# EasyEDA Pro project car1.eprj, schematic Schematic2

## Sheets
1 control: Board Name: Board2; Create Date: 2024-12-06; Page Name: control; Project Name: car1; Schematic Name: Schematic2; Update Date: 2025-03-01; Company: 嘉立创EDA; Page Size: A4; Version: V1.0
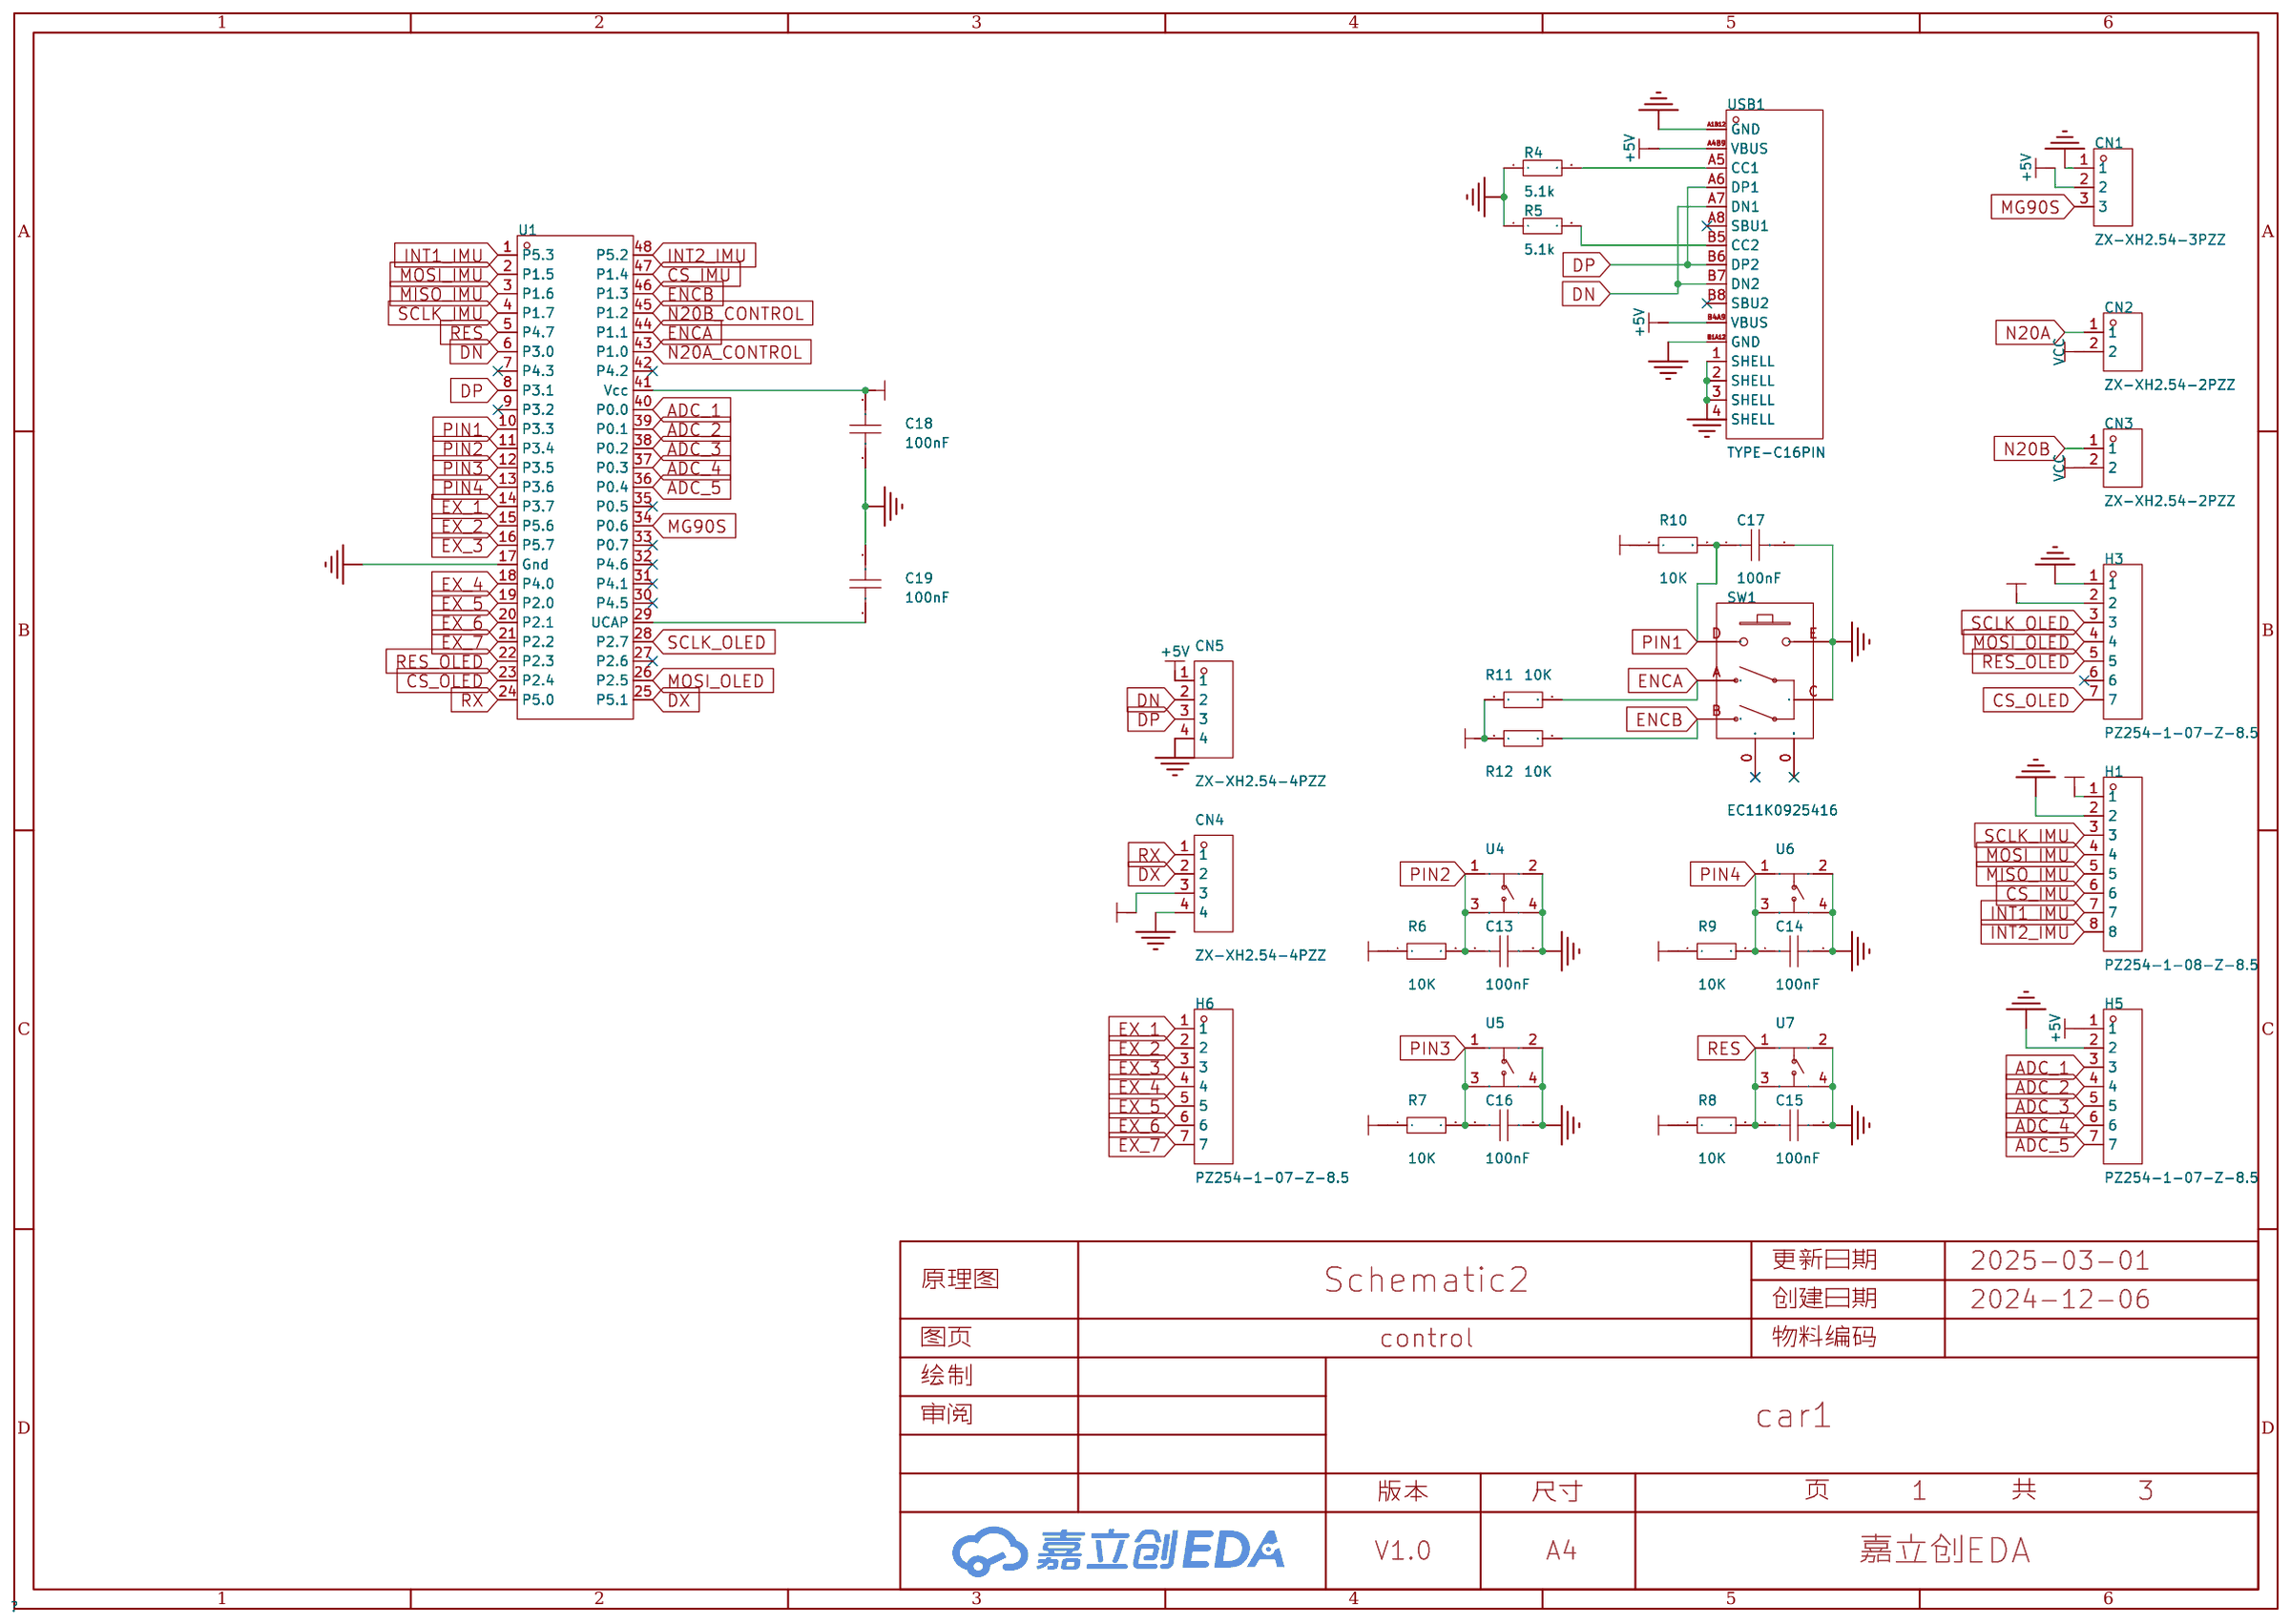
[diagram p1: control]
2 Power: Page Name: Power; Update Date: 2025-03-04
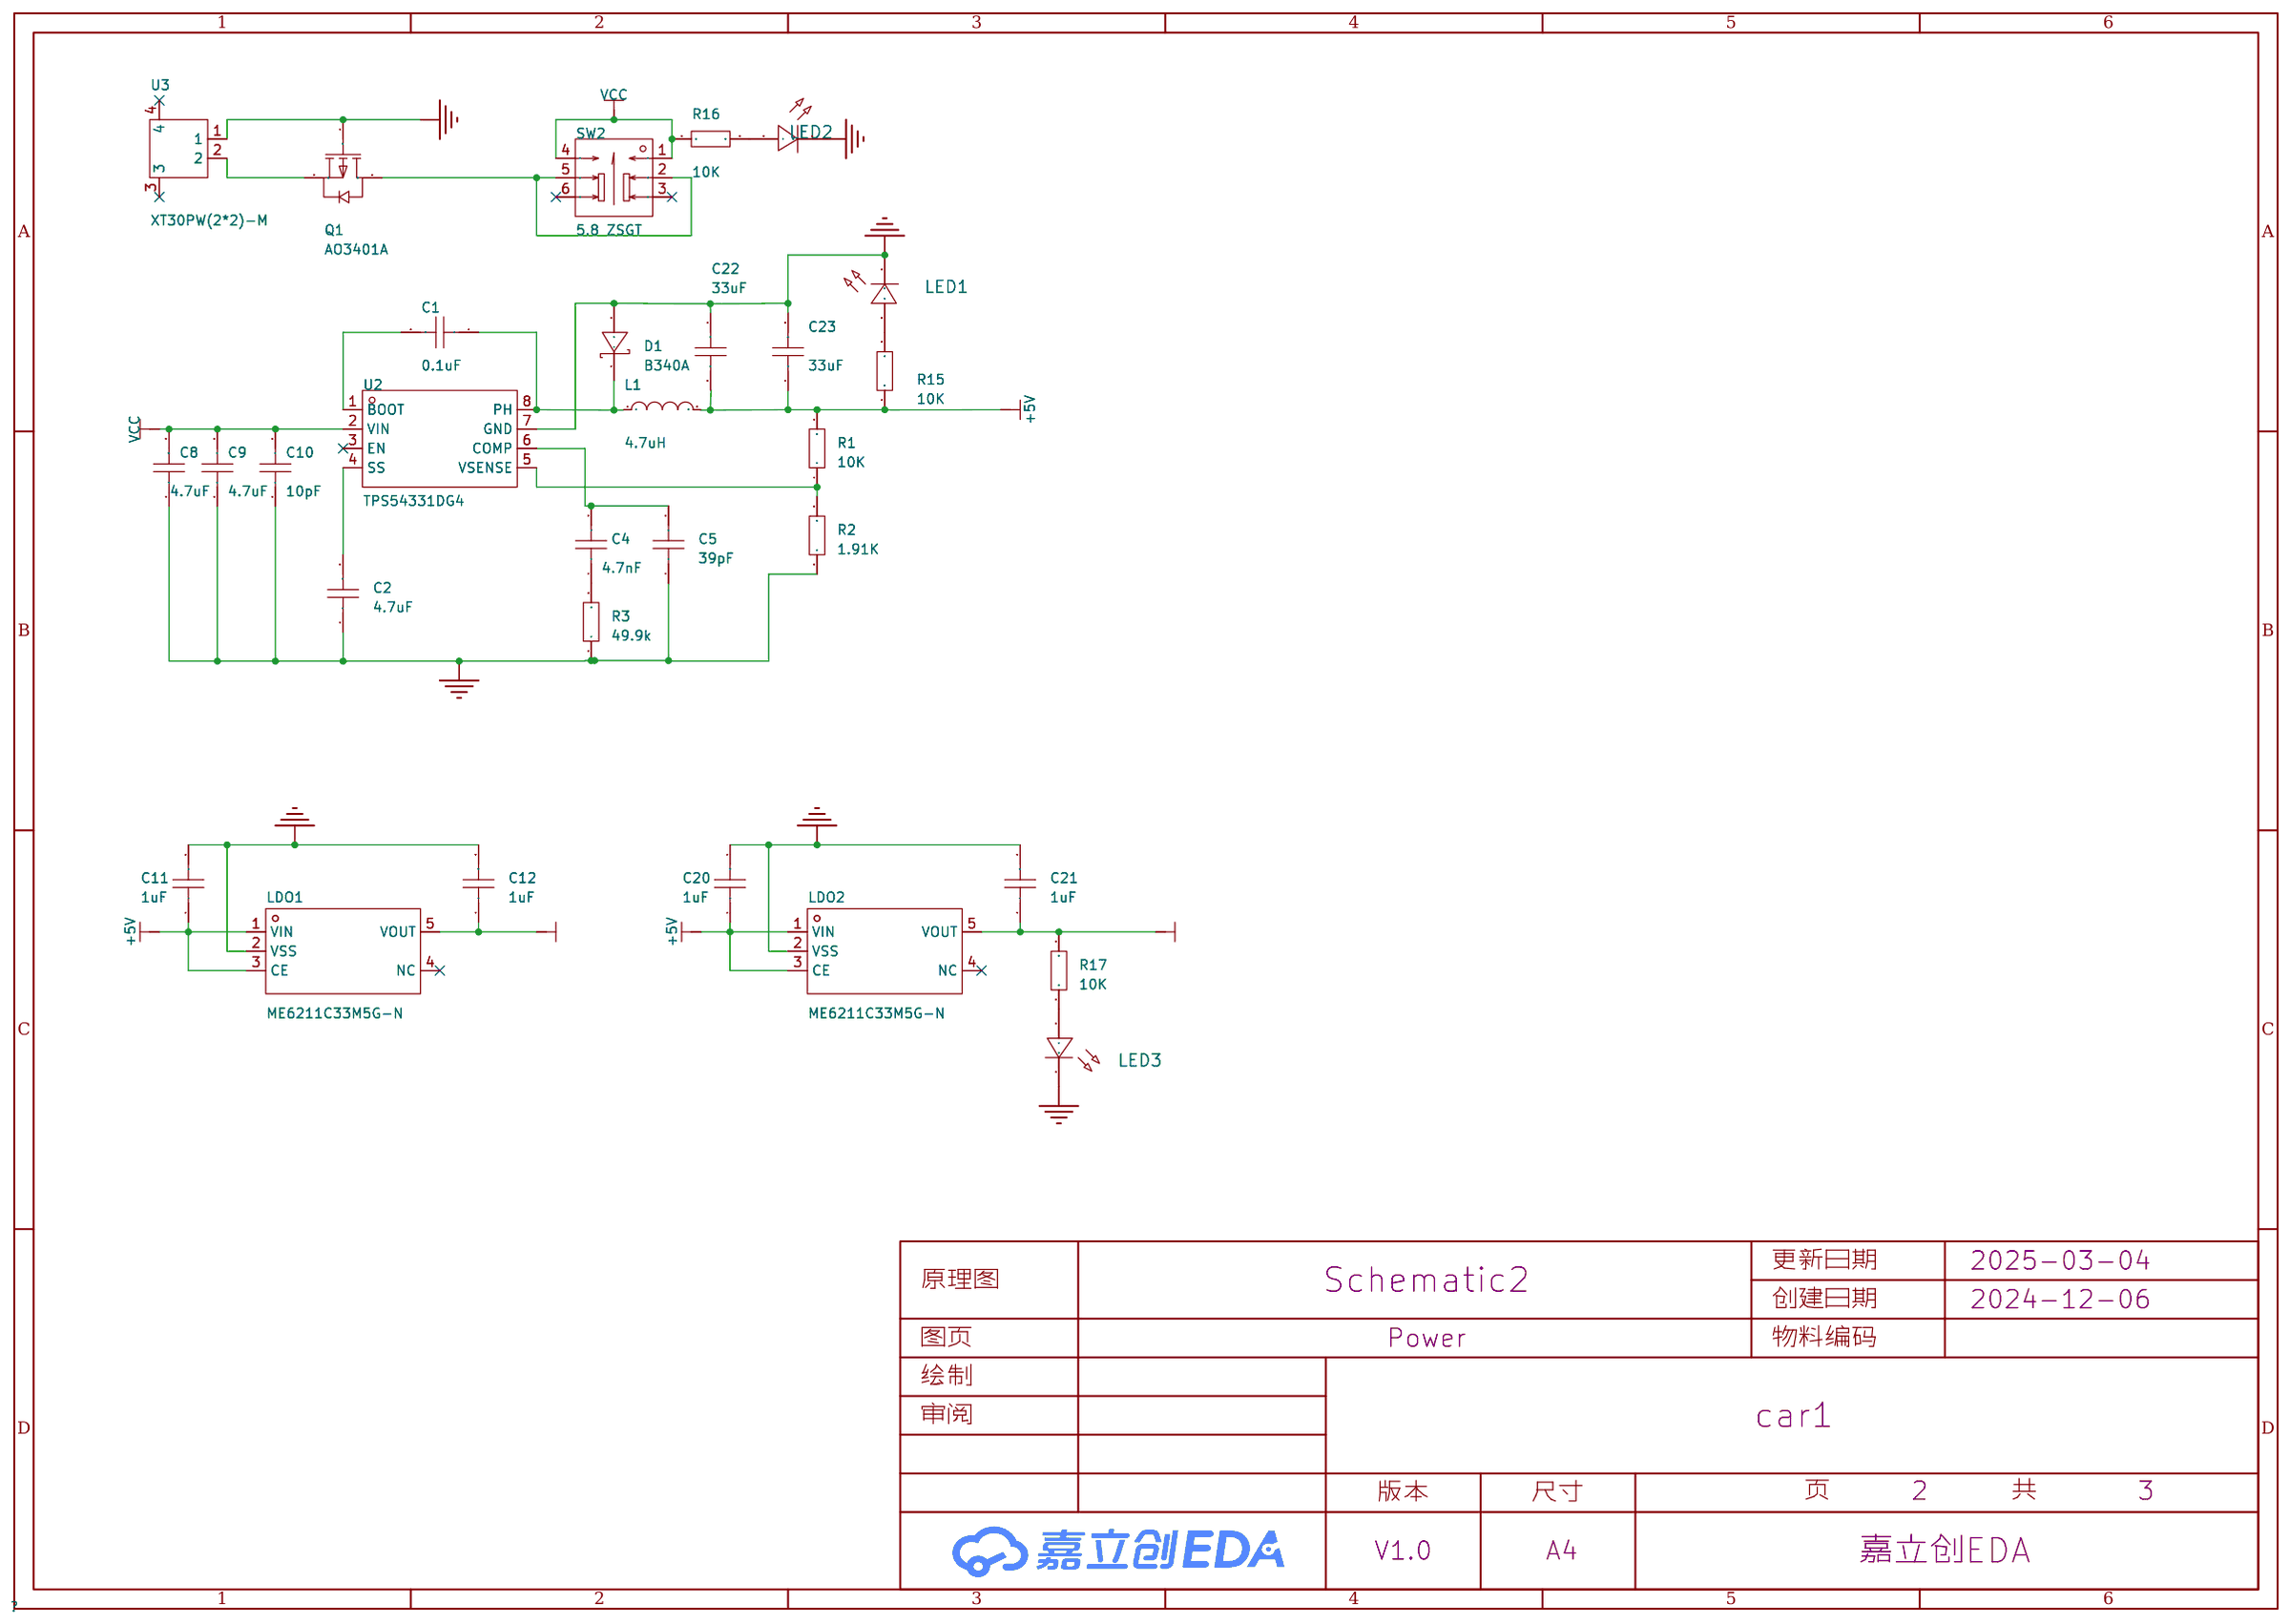
[diagram p2: Power]
3 3.Motor_Drive: Create Date: 2025-01-20; Page Name: 3.Motor_Drive; Update Date: 2025-02-26
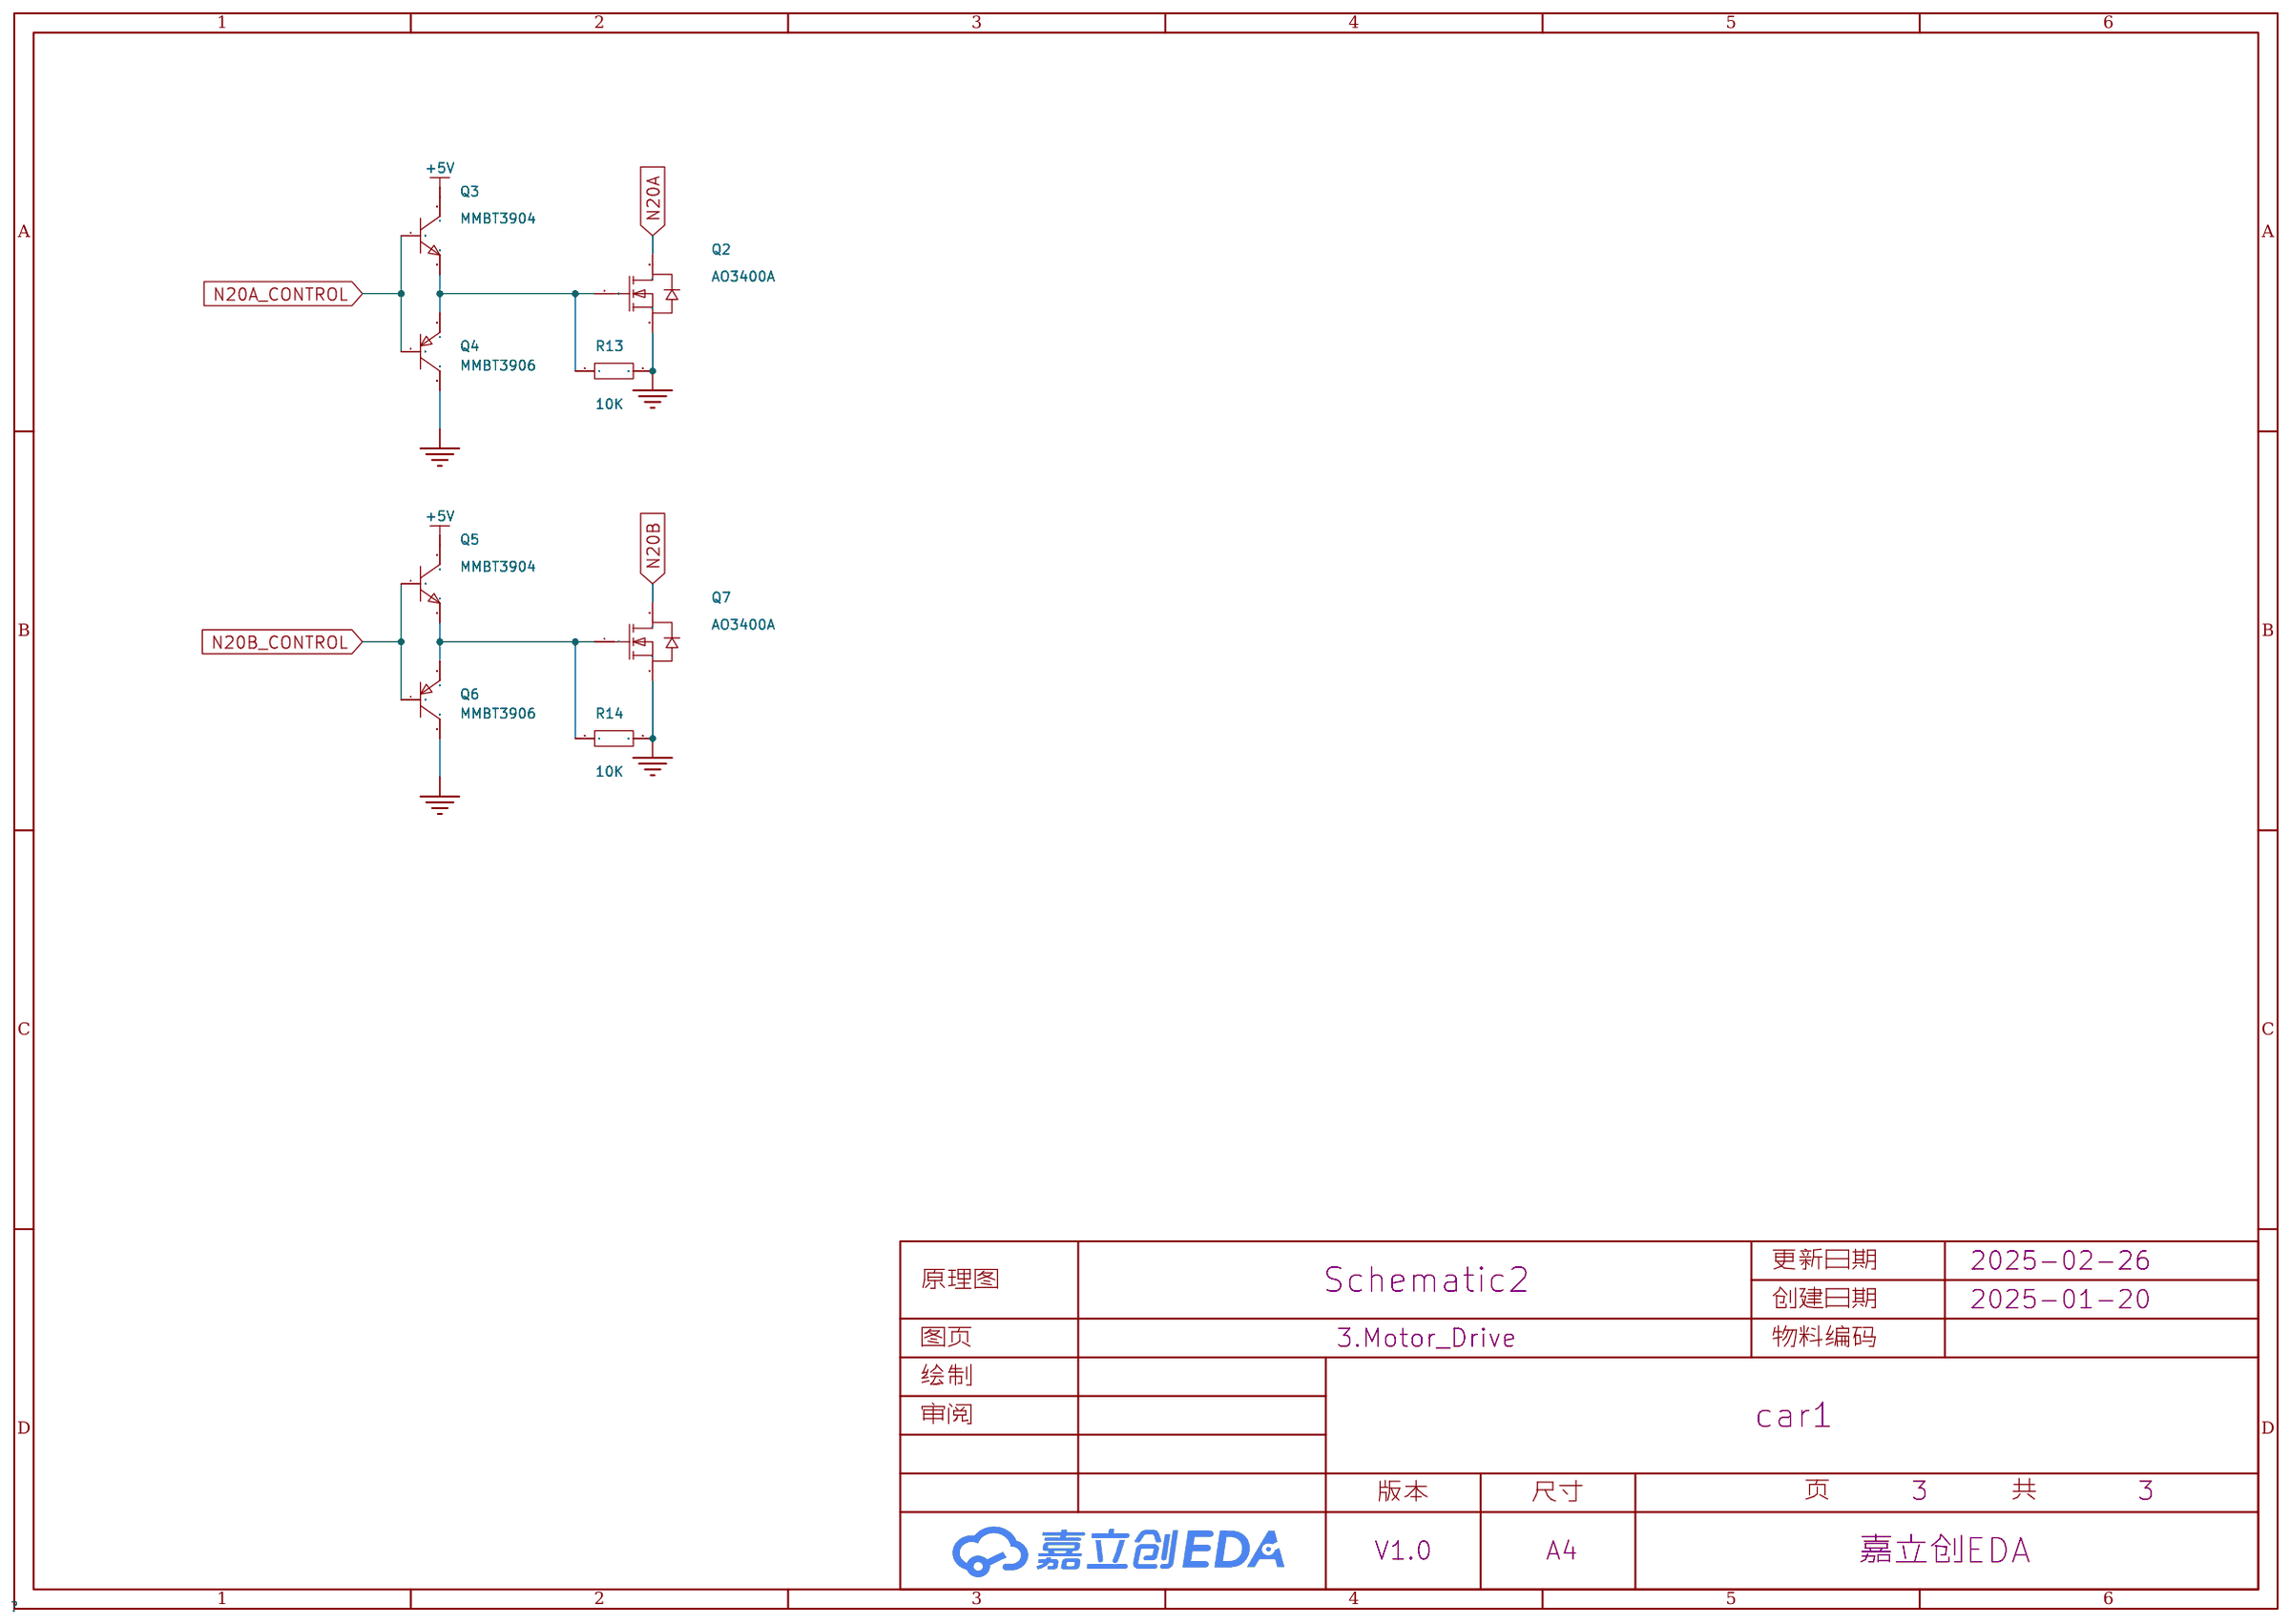
[diagram p3: 3.Motor_Drive]

## Parts
sheet 3.Motor_Drive
Q2  AO3400A  [SOT-23-3_L2.9-W1.3-P1.90-LS2.4-BR]
Q3  MMBT3904  [SOT-23-3_L2.9-W1.3-P1.90-LS2.4-BR]
Q4  MMBT3906  [SOT-23-3_L2.9-W1.3-P1.90-LS2.4-BR]
Q5  MMBT3904  [SOT-23-3_L2.9-W1.3-P1.90-LS2.4-BR]
Q6  MMBT3906  [SOT-23-3_L2.9-W1.3-P1.90-LS2.4-BR]
Q7  AO3400A  [SOT-23-3_L2.9-W1.3-P1.90-LS2.4-BR]
R13  10K  [R0402]
R14  10K  [R0402]
sheet control
C13  100nF  [C0402]
C14  100nF  [C0402]
C15  100nF  [C0402]
C16  100nF  [C0402]
C17  100nF  [C0402]
C18  100nF  [C0402]
C19  100nF  [C0402]
CN1  ZX-XH2.54-3PZZ  [CONN-TH_3P-P2.54_2501S-3P]
CN2  ZX-XH2.54-2PZZ  [CONN-TH_2P-P2.50_HX25003-2A]
CN3  ZX-XH2.54-2PZZ  [CONN-TH_2P-P2.50_HX25003-2A]
CN4  ZX-XH2.54-4PZZ  [CONN-TH_4P-P2.50_4PIN]
CN5  ZX-XH2.54-4PZZ  [CONN-TH_4P-P2.50_4PIN]
H1  PZ254-1-08-Z-8.5  [HDR-TH_8P-P2.54-V-M]
H3  PZ254-1-07-Z-8.5  [HDR-TH_07P-P2.54-V-M]
H5  PZ254-1-07-Z-8.5  [HDR-TH_07P-P2.54-V-M]
H6  PZ254-1-07-Z-8.5  [HDR-TH_07P-P2.54-V-M]
R4  5.1k  [R0402]
R5  5.1k  [R0402]
R6  10K  [R0402]
R7  10K  [R0402]
R8  10K  [R0402]
R9  10K  [R0402]
R10  10K  [R0402]
R11  10K  [R0402]
R12  10K  [R0402]
SW1  EC11K0925416  [SW-TH_EC11K0925416]
U1  AI8051U-34K64-QFP48  [LQFP-48_L7.0-W7.0-P0.50-LS9.0-BL_1]
U4  TC-6610 6*6*5 160g  [SW-TH_4P-L6.0-W6.0-P4.50-LS6.5]
U5  TC-6610 6*6*5 160g  [SW-TH_4P-L6.0-W6.0-P4.50-LS6.5]
U6  TC-6610 6*6*5 160g  [SW-TH_4P-L6.0-W6.0-P4.50-LS6.5]
U7  TC-6610 6*6*5 160g  [SW-TH_4P-L6.0-W6.0-P4.50-LS6.5]
USB1  TYPE-C16PIN  [USB-C-SMD_TYPE-C16PIN]
sheet Power
C1  0.1uF  [C0402]
C2  4.7uF  [C0402]
C4  4.7nF  [C0402]
C5  39pF  [C0402]
C8  4.7uF  [C0402]
C9  4.7uF  [C0402]
C10  10pF  [C0402]
C11  1uF  [C0402]
C12  1uF  [C0402]
C20  1uF  [C0402]
C21  1uF  [C0402]
C22  33uF  [C0603]
C23  33uF  [C0603]
D1  B340A  [SMA_L4.3-W2.6-LS5.1-RD]
L1  4.7uH  [IND-SMD_L4.9-W4.4_MAPM0420F]
LDO1  ME6211C33M5G-N  [SOT-23-5_L3.0-W1.7-P0.95-LS2.8-BL]
LDO2  ME6211C33M5G-N  [SOT-23-5_L3.0-W1.7-P0.95-LS2.8-BL]
LED1  -  [LED_0402]
LED2  -  [LED_0402]
LED3  -  [LED_0402]
Q1  AO3401A  [SOT-23_L2.9-W1.3-P1.90-LS2.4-BR]
R1  10K  [R0402]
R2  1.91K  [R0402]
R3  49.9k  [R0402]
R15  10K  [R0402]
R16  10K  [R0402]
R17  10K  [R0402]
SW2  5.8 ZSGT  [SW-TH_5.8ZSGT]
U2  TPS54331DG4  [SOIC-8_L4.9-W3.9-P1.27-LS6.0-BL]
U3  XT30PW(2*2)-M  [CONN-TH_XT30PW-M]

## Library data of the parts
Q2 Q7 = AO3400A_C20917: 类型:1个N沟道;漏源电压(Vdss):30V;连续漏极电流(Id):5.7A;导通电阻(RDS(on)@Vgs,Id):26.5mΩ@10V,5.7A;功率(Pd):1.4W;阈值电压(Vgs(th)@Id):1.5V@250uA;; LCSC Part Name: 1个N沟道 耐压:30V 电流:5.7A; Supplier Part: C20917; Manufacturer: AOS; Supplier Footprint: SOT-23-3L; JLCPCB Part Class: 基础库; Datasheet: https://atta.szlcsc.com/upload/public/pdf/source/20140107/1457706668533.pdf; Supplier: LCSC; Type: 1个N沟道; Drain Source Voltage (Vdss): 30V; Continuous Drain Current (Id): 5.7A; Drain Source On Resistance (RDS(on)@Vgs,Id): 26.5mΩ@10V,5.7A; Power Dissipation (Pd): 1.4W; Gate Threshold Voltage (Vgs(th)@Id): 1.5V@250uA; Total Gate Charge (Qg@Vgs): 7nC@4.5V; Input Capacitance (Ciss@Vds): 630pF@15V; Operating Temperature: -55℃~+150℃@(Tj)
Q3 Q5 = MMBT3904(RANGE:100-300): 晶体管类型:NPN;集电极电流(Ic):200mA;集射极击穿电压(Vceo):40V;功率(Pd):200mW;直流电流增益(hFE@Ic,Vce):100@10mA,1V;; LCSC Part Name: NPN 电流:200mA 耐压:40V hfe=100~300; Supplier Part: C20526; Manufacturer: CJ(江苏长电/长晶); Supplier Footprint: SOT-23; JLCPCB Part Class: 基础库; Datasheet: https://atta.szlcsc.com/upload/public/pdf/source/20220704/70F575FB75061E03F919270A6BB8BA7F.pdf; Supplier: LCSC; Transistor Type: NPN; Collector Current (Ic): 200mA; Collector-Emitter Breakdown Voltage (Vceo): 40V; Power Dissipation (Pd): 200mW; DC Current Gain (hFE@Ic,Vce): 100@10mA,1V; Transition Frequency (fT): 300MHz; Collector Cut-Off Current (Icbo): 100nA; Collector-Emitter Saturation Voltage (VCE(sat)@Ic,Ib): 300mV@50mA,5mA
Q4 Q6 = MMBT3906_C18195368: Supplier Part: C18195368; Manufacturer: LJ(朗捷）; Supplier Footprint: SOT-23; Datasheet: https://atta.szlcsc.com/upload/public/pdf/source/20230921/EBEA0117477174C76530FD120E2EA419.pdf; Supplier: LCSC
R1-R17 = Res_0402: Supplier Footprint: 0402
C2 C4 C5 C8-C21 = CAP_0402: Supplier Footprint: 0402
CN1 = ZX-XH2.54-3PZZ: 插针结构:1x3P;间距:2.54mm;安装方式:直插;参考系列:XH;总PIN数:3P;排数:1;每排PIN数:3;行距:-;额定电流:3A;触头材质:黄铜;触头镀层:锡;工作温度范围:-25℃~+85℃;; Supplier Part: C7429633; Manufacturer: Megastar(兆星); Supplier Footprint: 插件,P=2.54mm; JLCPCB Part Class: 扩展库; Datasheet: https://atta.szlcsc.com/upload/public/pdf/source/20230619/AE17037A2CFDBE8D9CBA775D61AD0A84.pdf; Supplier: LCSC; Pins Structure: 1x3P; Pitch: 2.54mm; Mounting Style: 直插; Reference Series: XH; Number of Pins: 3P; Number of Rows: 1; Number of PINs Per Row: 3; Current Rating (Max): 3A; Contact Material: 黄铜; Contact Plating: 锡; Operating Temperature Range: -25℃~+85℃
CN2 CN3 = ZX-XH2.54-2PZZ: 插针结构:1x2P;间距:2.54mm;安装方式:直插;参考系列:XH;总PIN数:2P;排数:1;每排PIN数:2;行距:-;额定电流:3A;触头材质:黄铜;触头镀层:锡;工作温度范围:-25℃~+85℃;; Supplier Part: C7429632; Manufacturer: Megastar(兆星); Supplier Footprint: 插件,P=2.54mm; JLCPCB Part Class: 扩展库; Datasheet: https://atta.szlcsc.com/upload/public/pdf/source/20230619/19BA6947230AA44A04D3EDD65E618FD0.pdf; Supplier: LCSC; Pins Structure: 1x2P; Pitch: 2.54mm; Mounting Style: 直插; Reference Series: XH; Number of Pins: 2P; Number of Rows: 1; Number of PINs Per Row: 2; Current Rating (Max): 3A; Contact Material: 黄铜; Contact Plating: 锡; Operating Temperature Range: -25℃~+85℃
CN4 CN5 = ZX-XH2.54-4PZZ: 插针结构:1x4P;间距:2.54mm;安装方式:直插;参考系列:XH;总PIN数:4P;排数:1;每排PIN数:4;行距:-;额定电流:3A;触头材质:黄铜;触头镀层:锡;工作温度范围:-25℃~+85℃;; Supplier Part: C7429634; Manufacturer: Megastar(兆星); Supplier Footprint: 插件,P=2.5mm; JLCPCB Part Class: 扩展库; Datasheet: https://atta.szlcsc.com/upload/public/pdf/source/20230619/B529A2163E0159A644AB3383D208FB03.pdf; Supplier: LCSC; Pins Structure: 1x4P; Pitch: 2.54mm; Mounting Style: 直插; Reference Series: XH; Number of Pins: 4P; Number of Rows: 1; Number of PINs Per Row: 4; Current Rating (Max): 3A; Contact Material: 黄铜; Contact Plating: 锡; Operating Temperature Range: -25℃~+85℃
H1 = PZ254-1-08-Z-8.5: 插针结构:1x8P;间距:2.54mm;行距:-;圆针/方针:方针;安装类型:直插;排数:单排;总PIN位数:8P;额定电流:3A;额定电压:-;配合针长度:6mm;塑高:2.5mm;端接针长度:3mm;触头材质:黄铜;工作温度范围:-40℃~+105℃;焊接温度(最大值):260℃@10S;颜色:黑色;; LCSC Part Name: 1x8P 间距:2.54mm 方针 直插; Supplier Part: C2894931; Manufacturer: HCTL(华灿天禄); Supplier Footprint: 插件,P=2.54mm; JLCPCB Part Class: 扩展库; Datasheet: https://atta.szlcsc.com/upload/public/pdf/source/20240305/0F0A2A5C422E5D195558C9C26715A031.pdf; Supplier: LCSC; Pin Structure: 1x8P; Pitch: 2.54mm; Circluar Pins/Square Pins: 方针; Mounting Type: 直插; Number of Rows: 单排; Number of Pins: 8P; Current Rating (Max): 3A; Length of Mating Pin: 6mm; Insulation Height: 2.5mm; Length of End Connection Pin: 3mm; Contact Material: 黄铜; Operating Temperature Range: -40℃~+105℃; Soldering Temperature(Max): 260℃@10S; Color: 黑色
H3 H5 H6 = PZ254-1-07-Z-8.5: 插针结构:1x7P;间距:2.54mm;行距:-;圆针/方针:方针;安装类型:直插;排数:单排;总PIN位数:7P;额定电流:3A;额定电压:-;配合针长度:6mm;塑高:2.5mm;端接针长度:3mm;触头材质:黄铜;工作温度范围:-40℃~+105℃;焊接温度(最大值):260℃@10S;颜色:黑色;; LCSC Part Name: 1x7P 间距:2.54mm 方针 直插; Supplier Part: C2894930; Manufacturer: HCTL(华灿天禄); Supplier Footprint: 插件,P=2.54mm; JLCPCB Part Class: 扩展库; Datasheet: https://atta.szlcsc.com/upload/public/pdf/source/20240305/0F0A2A5C422E5D195558C9C26715A031.pdf; Supplier: LCSC; Pin Structure: 1x7P; Pitch: 2.54mm; Circluar Pins/Square Pins: 方针; Mounting Type: 直插; Number of Rows: 单排; Number of Pins: 7P; Current Rating (Max): 3A; Length of Mating Pin: 6mm; Insulation Height: 2.5mm; Length of End Connection Pin: 3mm; Contact Material: 黄铜; Operating Temperature Range: -40℃~+105℃; Soldering Temperature(Max): 260℃@10S; Color: 黑色
SW1 = EC11K0925416: Supplier Part: C219777; Manufacturer: ALPSALPINE(阿尔卑斯阿尔派); Supplier Footprint: 插件; JLCPCB Part Class: 扩展库; Datasheet: https://atta.szlcsc.com/upload/public/pdf/source/20220222/29C2476E448AF88AA1E99A46D9435970.pdf; Supplier: LCSC
U1 = AI8051U-34K64-QFP48: 硬件浮点/硬件三角函数 跑100MHz, 32位8051-CPU 跑 42MHz，PWM 有硬件移相功能，DMA支持外设到外设，DMA支持PWM; Supplier Part: C41427635; Manufacturer: STC; Supplier Footprint: QFP-48; JLCPCB Part Class: 扩展库; Datasheet: https://atta.szlcsc.com/upload/public/pdf/source/20241012/98E0A3F17C9CC280218AE3F266CCDE47.pdf; Supplier: LCSC
U4-U7 = TC-6610 6*6*5 160g: 轻触开关  6*6*5 160g力 4.3基座 复银 耐温 ROHS; Supplier Part: C7528706; Manufacturer: FG(富港); Supplier Footprint: 插件,6x6mm; JLCPCB Part Class: 扩展库; Datasheet: https://atta.szlcsc.com/upload/public/pdf/source/20240119/C4B5B07B03893BE63D1CA58047A0B7F3.pdf; Supplier: LCSC
USB1 = TYPE-C16PIN: 连接器类型:Type-C;标准:USB 3.1;公母:母;安装方式:卧贴;触点数量:16P;端口数量:1;额定电流 - 电源:3A;工作温度范围:-40℃~+85℃;; LCSC Part Name: Type-C 母 卧贴; Supplier Part: C393939; Manufacturer: SHOU HAN(首韩); Supplier Footprint: SMD; JLCPCB Part Class: 扩展库; Datasheet: https://atta.szlcsc.com/upload/public/pdf/source/20190521/C393939_7B9043D4CF1026AF443AB60D91FBCD5C.pdf; Supplier: LCSC; Connector Type: Type-C; Standard: USB 3.1; Gender: 母; Mounting Style: 卧贴; Number of Contacts: 16P; Number of Ports: 1; Current Rating - Power (Max): 3A; Operating Temperature Range: -40℃~+85℃; Rated Voltage (Max): 30V; Connect-Disconnect Life: 1万次; Core Colour: 黑色
C1 = CAP_0402: MLCC; Supplier Footprint: 0402
C22 C23 = CAP_0603: Supplier Footprint: 0603
D1 = B340A: 二极管配置:独立式;正向压降(Vf):550mV@3A;直流反向耐压(Vr):40V;整流电流:3A;; LCSC Part Name: 电压:40V 电流:3A; Supplier Part: C64982; Manufacturer: MDD(辰达半导体); Supplier Footprint: SMA(DO-214AC); JLCPCB Part Class: 扩展库; Datasheet: https://atta.szlcsc.com/upload/public/pdf/source/20240710/591710C3B34CDB7FE3DA92C119E6F598.pdf; Supplier: LCSC; Diode Configuration: 独立式; Forward Voltage (Vf@If): 550mV@3A; Reverse Voltage (Vr): 40V; Rectified Current: 3A; Reverse Leakage Current (Ir): 500uA@40V
L1 = HA42-4R7MT: 电感值:4.7uH;精度:±20%;额定电流:2A;饱和电流(Isat):3A;; LCSC Part Name: 4.7uH ±20% 3A; Supplier Part: C2936653; Manufacturer: FH(风华); Supplier Footprint: 0420; JLCPCB Part Class: 扩展库; Datasheet: https://atta.szlcsc.com/upload/public/pdf/source/20211228/DF5AAD1C624D1DACD739A51BD94418BC.pdf; Supplier: LCSC; Tolerance: ±20%; Rated Current: 2A; Saturation Current (Isat): 3A; DC Resistance (DCR): 150mΩ
LDO1 LDO2 = ME6211C33M5G-N: 输出类型:固定;最大输入电压:6V;输出电压:3.3V;最大输出电流:500mA;电源纹波抑制比(PSRR):70dB;输出极性:正极;; LCSC Part Name: 输入6V 输出3.3V 500mA; Supplier Part: C82942; Manufacturer: MICRONE(南京微盟); Supplier Footprint: SOT-23-5; JLCPCB Part Class: 扩展库; Datasheet: https://atta.szlcsc.com/upload/public/pdf/source/20170918/C82942_1505727073070976520.pdf; Supplier: LCSC; Output Type: 固定; Maximum Input Voltage: 6V; Output Voltage: 3.3V; MAX Output Current: 500mA; Power Supply Rejection Ratio (PSRR): 70dB; Dropout Voltage: 260mV@(200mA); Output Polarity: 正极; Number of Outputs: 1
LED1-LED3 = LED_0402-R: Supplier Footprint: 0402
Q1 = AO3401A_C15127: 类型:1个P沟道;漏源电压(Vdss):30V;连续漏极电流(Id):4A;导通电阻(RDS(on)@Vgs,Id):44mΩ@10V,4.3A;功率(Pd):1.4W;阈值电压(Vgs(th)@Id):1.3V@250uA;; LCSC Part Name: 1个P沟道 耐压:30V 电流:4A; Supplier Part: C15127; Manufacturer: AOS; Supplier Footprint: SOT-23; JLCPCB Part Class: 基础库; Datasheet: https://atta.szlcsc.com/upload/public/pdf/source/20160507/1462613609053.pdf; Supplier: LCSC; Type: 1个P沟道; Drain Source Voltage (Vdss): 30V; Continuous Drain Current (Id): 4A; Drain Source On Resistance (RDS(on)@Vgs,Id): 44mΩ@10V,4.3A; Power Dissipation (Pd): 1.4W; Gate Threshold Voltage (Vgs(th)@Id): 1.3V@250uA; Total Gate Charge (Qg@Vgs): 12.2nC@4.5V; Input Capacitance (Ciss@Vds): 1.2nF@15V; Operating Temperature: -55℃~+150℃@(Tj)
SW2 = 5.8 ZSGT: 电路结构:双刀双掷;自锁/无锁:自锁;安装方式:直插;触点电流:110mA;额定电压 (DC):30V;带灯:不带;作用力:1.5N;机械寿命:10万次;; LCSC Part Name: 5.8*5.8有头/高头 带锁/自锁开关 泡泡机开关; Supplier Part: C2681587; Manufacturer: SHOU HAN(首韩); Supplier Footprint: 插件; JLCPCB Part Class: 扩展库; Datasheet: https://atta.szlcsc.com/upload/public/pdf/source/20210107/C2681587_CDDDDA4A1C7AC9FEB01815B75893A6BA.pdf; Supplier: LCSC; Circuit: 双刀双掷; Self Lock / No Lock: 自锁; Actuator Style: 方形按钮; Mounting Style: 直插; Contact Current: 110mA; Voltage Rating (DC): 30V; Insulation Resistance: 100MΩ; Actuator/Cap Color: 白色; With Lamp: 不带; Pin Style: PC引脚; Operating Force: 1.5N; Operating Temperature: -10℃~+70℃; Mechanical Life: 10万次
U2 = TPS54331DG4: 功能类型:降压型;输出类型:可调;输入电压:3.5V~28V;输出电压:800mV~25V;输出电流:3A;; Supplier Part: C1356164; Manufacturer: TI(德州仪器); Supplier Footprint: SOIC-8; JLCPCB Part Class: 扩展库; Datasheet: https://www.ti.com/cn/lit/gpn/tps54331; Supplier: LCSC; Function: 降压型; Output Type: 可调; Input Voltage: 3.5V~28V; Output Voltage: 800mV~25V; Output Current: 3A; Switching Frequency: 570kHz; Operating Temperature: -40℃~+150℃@(TJ); Synchronous Rectification: 否; Number of Outputs: 1; Topology: 降压式; Switch tube (built-in/external): 内置
U3 = XT30PW(2*2)-M: Supplier Part: C9900097120; JLCPCB Part Class: 扩展库; Supplier: LCSC

## Nets
3.3V: C12.1 C18.2 C21.1 CN4.3 H1.1 H3.2 LDO1.5(VOUT) LDO2.5(VOUT) R6.1 R7.1 R8.1 R9.1 R10.1 R11.1 R12.1 R17.1 U1.41(Vcc)
+5V: C11.1 C20.1 C23.1 CN1.2 CN5.1 H5.1 LDO1.1(VIN) LDO1.3(CE) LDO2.1(VIN) LDO2.3(CE) Q3.3(C) Q5.3(C) R1.2 R15.1 USB1.A4B9(VBUS) USB1.B4A9(VBUS)
GND: C2.1 C5.1 C8.1 C9.1 C10.1 C11.2 C12.2 C13.2 C14.2 C15.2 C16.2 C17.2 C18.1 C19.1 C20.2 C21.2 C22.1 C23.2 CN1.1 CN4.4 CN5.4 D1.2(A) H1.2 H3.1 H5.2 LDO1.2(VSS) LDO2.2(VSS) LED1.1(C) LED2.1(C) LED3.1(C) Q1.1(G) Q2.2(S) Q4.3(C) Q6.3(C) Q7.2(S) R2.1 R3.1 R4.1 R5.1 R13.2 R14.2 SW1.C SW1.E U1.17(Gnd) U2.7(GND) U3.1 U4.2 U4.4 U5.2 U5.4 U6.2 U6.4 U7.2 U7.4 USB1.1(SHELL) USB1.2(SHELL) USB1.3(SHELL) USB1.4(SHELL) USB1.A1B12(GND) USB1.B1A12(GND)
VCC: C8.2 C9.2 C10.2 CN2.2 CN3.2 R16.1 SW2.1 SW2.4 U2.2(VIN)
ADC_1: H5.3 U1.40(P0.0)
ADC_2: H5.4 U1.39(P0.1)
ADC_3: H5.5 U1.38(P0.2)
ADC_4: H5.6 U1.37(P0.3)
ADC_5: H5.7 U1.36(P0.4)
CS_IMU: H1.6 U1.47(P1.4)
CS_OLED: H3.7 U1.23(P2.4)
DN: CN5.2 U1.6(P3.0) USB1.A7(DN1) USB1.B7(DN2)
DP: CN5.3 U1.8(P3.1) USB1.A6(DP1) USB1.B6(DP2)
DX: CN4.2 U1.25(P5.1)
ENCA: R11.2 SW1.A U1.44(P1.1)
ENCB: R12.2 SW1.B U1.46(P1.3)
EX_1: H6.1 U1.14(P3.7)
EX_2: H6.2 U1.15(P5.6)
EX_3: H6.3 U1.16(P5.7)
EX_4: H6.4 U1.18(P4.0)
EX_5: H6.5 U1.19(P2.0)
EX_6: H6.6 U1.20(P2.1)
EX_7: H6.7 U1.21(P2.2)
INT1_IMU: H1.7 U1.1(P5.3)
INT2_IMU: H1.8 U1.48(P5.2)
MG90S: CN1.3 U1.34(P0.6)
MISO_IMU: H1.5 U1.3(P1.6)
MOSI_IMU: H1.4 U1.2(P1.5)
MOSI_OLED: H3.4 U1.26(P2.5)
N20A: CN2.1 Q2.3(D)
N20A_CONTROL: Q3.1(B) Q4.1(B) U1.43(P1.0)
N20B: CN3.1 Q7.3(D)
N20B_CONTROL: Q5.1(B) Q6.1(B) U1.45(P1.2)
PIN1: C17.1 R10.2 SW1.D U1.10(P3.3)
PIN2: C13.1 R6.2 U1.11(P3.4) U4.1 U4.3
PIN3: C16.1 R7.2 U1.12(P3.5) U5.1 U5.3
PIN4: C14.1 R9.2 U1.13(P3.6) U6.1 U6.3
RES: C15.1 R8.2 U1.5(P4.7) U7.1 U7.3
RES_OLED: H3.5 U1.22(P2.3)
RX: CN4.1 U1.24(P5.0)
SCLK_IMU: H1.3 U1.4(P1.7)
SCLK_OLED: H3.3 U1.28(P2.7)
$1N1528: R4.2 USB1.A5(CC1)
$1N1529: R5.2 USB1.B5(CC2)
$1N6312: C19.2 U1.29(UCAP)
$2N526: C1.2 U2.1(BOOT)
$2N663: C2.2 U2.4(SS)
$2N1009: R1.1 R2.2 U2.5(VSENSE)
$2N1098: C4.2 C5.2 U2.6(COMP)
$2N1203: C4.1 R3.2
$2N6020: Q1.2(S) U3.2
$2N6234: Q1.3(D) SW2.2 SW2.5
$2N8349: LED1.2(A) R15.2
$2N8478: LED2.2(A) R16.2
$2N8587: LED3.2(A) R17.2
$3N447: Q2.1(G) Q3.2(E) Q4.2(E) R13.1
$3N743: Q5.2(E) Q6.2(E) Q7.1(G) R14.1
Net-(C1-1): C1.1 D1.1(K) U2.8(PH)

Not connected (* = marked no-connect by the designer): C22 2; H3 6*; L1 1 2; LDO1 4(NC)*; LDO2 4(NC)*; SW1 0(MH1)*; SW2 3* 6*; U1 7(P4.3)* 9(P3.2)* 27(P2.6)* 30(P4.5)* 31(P4.1)* 32(P4.6)* 33(P0.7)* 35(P0.5)* 42(P4.2)*; U2 3(EN)*; U3 3* 4*; USB1 A8(SBU1)* B8(SBU2)*
